# EAGLE design control (EAGLE 9.3.1)
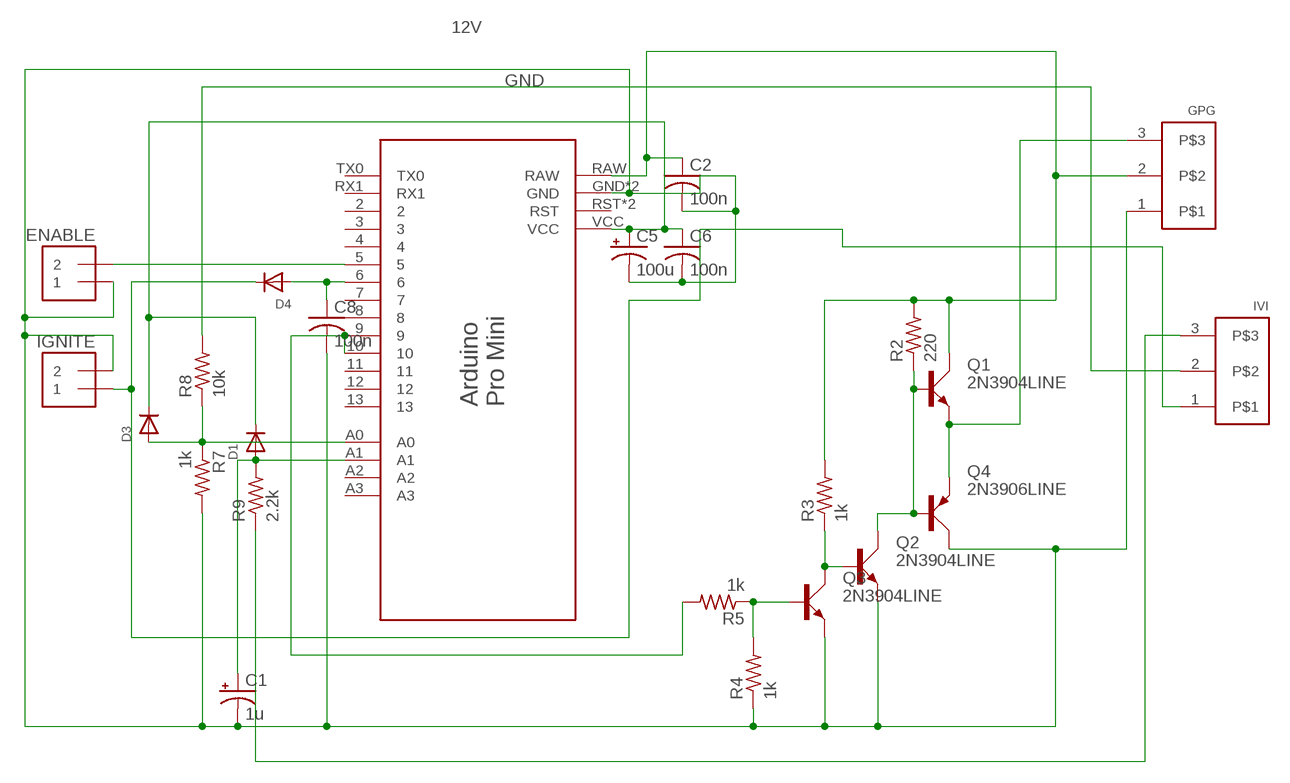
[diagram p0: schematic, sheet 1]

## Parts
C1  1u  CPOL-USE2.5-6  [E2,5-6]
C2  100n  C-US050-030X075  [C050-030X075]
C5  100u  CPOL-USE2.5-6  [E2,5-6]
C6  100n  C-US050-025X075  [C050-025X075]
C8  100n  C-US050-025X075  [C050-025X075]
D1  DIODEDO-1N4148  [DO-1N4148]
D3  DIODEDO-1N4148  [DO-1N4148]
D4  DIODEDO-1N4148  [DO-1N4148]
ENABLE  1X2_12PINS  [1X2PINS]
GPG  1X3_123  [1X3_123]
IGNITE  1X2_12HORZPINS  [1X2HORZ]
IVI  1X3_123  [1X3_123]
Q1  2N3904LINE  [TO92-LINE]
Q2  2N3904LINE  [TO92-LINE]
Q3  2N3904LINE  [TO92-LINE]
Q4  2N3906LINE  [TO92-LINE]
R2  220  R-US_0204/5  [0204/5]
R3  1k  R-US_0207/2V  [0207/2V]
R4  1k  R-US_0207/2V  [0207/2V]
R5  1k  R-US_0207/15  [0207/15]
R7  1k  R-US_0207/5V  [0207/5V]
R8  10k  R-US_0207/15  [0207/15]
R9  2.2k  R-US_0207/12  [0207/12]
U$1  PRO_MINI  [PRO_MINI]

## Nets
12V: C2.1 GPG.2 Q1.C R2.2 R3.2 U$1.RAW
GND: C1.- C2.2 C5.- C6.2 C8.2 ENABLE.1 GPG.1 IGNITE.2 Q2.E Q3.E Q4.C R4.1 R7.2 U$1.GND U$1.GND1(GND)
N$1: D3.A R7.1 R8.1 U$1.A0
N$2: C5.+ C6.1 D1.C D3.C U$1.VCC
N$8: GPG.3 Q1.E Q4.E
N$9: Q3.B R4.2 R5.1
N$10: Q1.B Q2.C Q4.B R2.1
N$11: Q2.B Q3.C R3.1
N$12: R5.2 U$1.9 U$1.10
N$16: C1.+ D1.A R9.2 U$1.A1
N$18: IVI.3 R9.1
N$19: IVI.2 R8.2
N$20: ENABLE.2 U$1.5
N$21: C8.1 D4.A U$1.6
N$22: D4.C IGNITE.1 IVI.1
Unconnected: U$1.2 U$1.3 U$1.4 U$1.7 U$1.8 U$1.11 U$1.12 U$1.13 U$1.A2 U$1.A3 U$1.RST U$1.RST1(RST) U$1.RX1 U$1.TX0

## Library data of the parts
C1 C5 = adafruit:CPOL-US: POLARIZED CAPACITOR, American symbol
C2 C6 C8 = adafruit:C-US: CAPACITOR, American symbol
D1 D3 D4 = adafruit:DIODE: Diode SMADIODE - SMA Surface Mount Package 20V 1A Schottky Diode Digikey: 641-1014-6-ND DO-1N4148 - Through Hole Small Current Diode SOD-123 20V 1 A (.5mV Vf) Schottky Diode - Digikey: MBRX120TPMSCT-ND SOD-323 10V 570mA (.38mV Vf, 3ns) Schottky Diode - Digikey: ZLLS410CT-ND SOD-523 30V 30mA Schottky Diode (RB751S-40TE61) - Digikey: RB751S-40TE61CT-ND SOT23-R/W - SOT23 Package (R = Solder Paste/Reflow Ovens, W = Hand-Soldering) BAT54Film 40V 300mA - Digikey: 497-7162-1-ND
ENABLE IGNITE = aaaacustom:1X2_12: 3.5mm Terminal block http://www.ladyada.net/library/pcb/eaglelibrary.html
GPG IVI = aaaacustom:1X3_123
Q1-Q3 = transistor-small-signal:2N3904: NPN TRANSISTOR
Q4 = transistor-small-signal:2N3906: PNP TRANSISTOR
R2-R5 R7-R9 = adafruit:R-US_: RESISTOR, American symbol
U$1 = Arduino_Pro_Mini:PRO_MINI

## Board
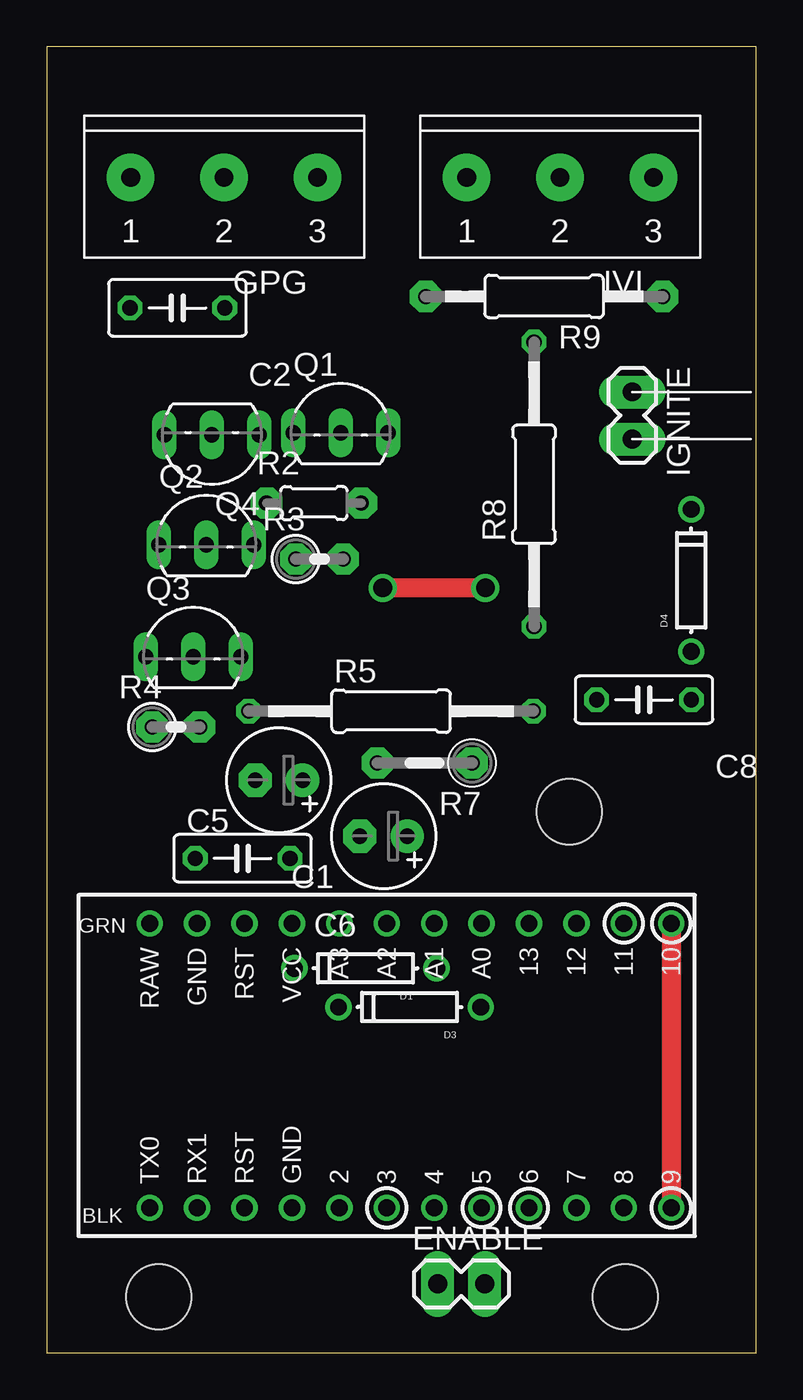
[diagram p1: board, top side]
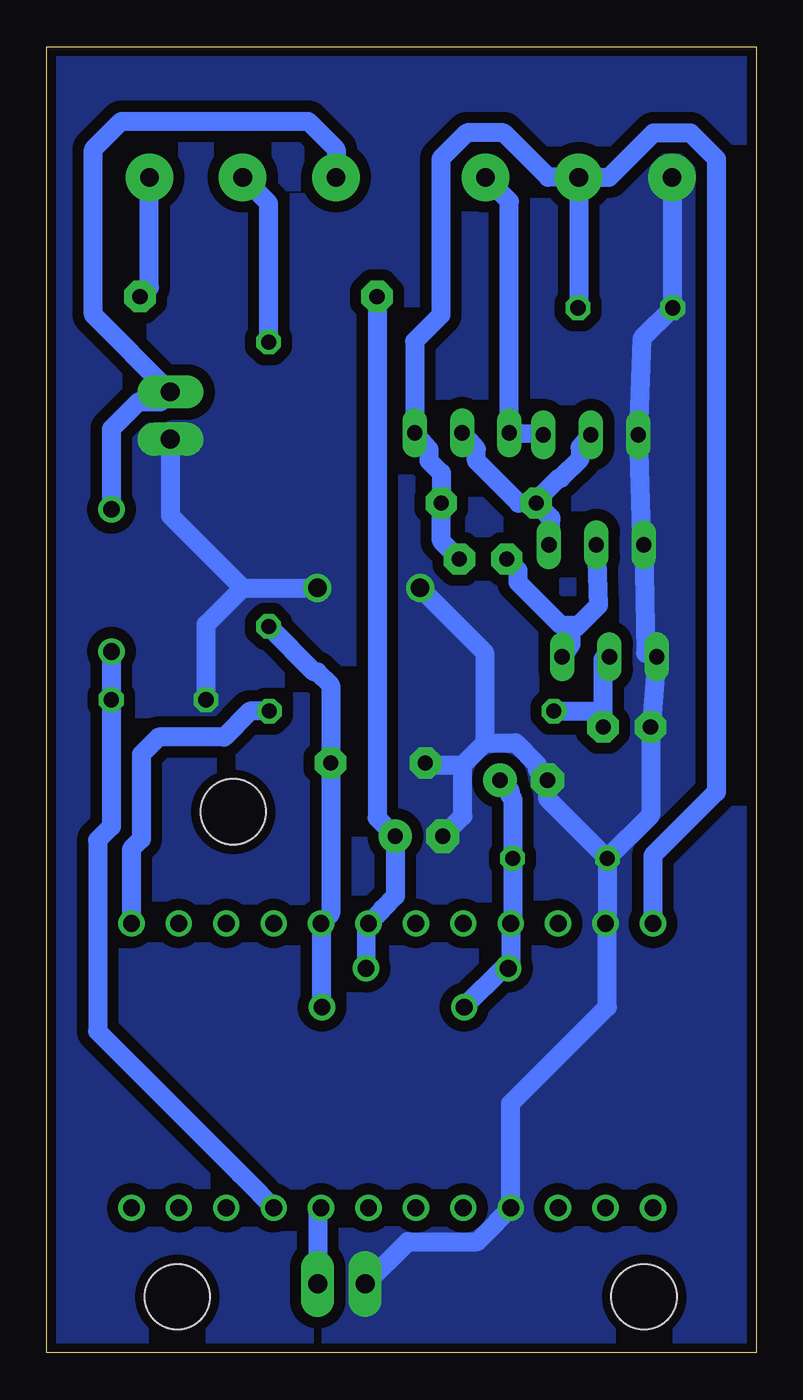
[diagram p2: board, bottom side, seen from below]

Size 38 x 70 mm. Coordinates in mm from the lower left corner, seen from the top.
Outline: 0,0 38,0 38,70 0,70 0,0
Copper layers (1*16): Top 0.035mm / dielectric 1.5mm / Bottom 0.035mm
Design rules "default": minimum track width 1mm, minimum drill 1mm, track to track 0.6mm, track to pad 0.6mm, pad to pad 0.5mm, via to via 0.6mm, smd to smd 6mil, copper to edge 0.5mm, drill to drill 0.5mm, minimum pad ring 10mil, minimum via ring 8mil, stop-mask expansion 4mil, vias tented up to drill 0mil, thermal gap 10mil
Holes 3.5 mm at 28,29 6,3 31,3

### Footprints (pad centres in the part's own frame; a part is rotated, then mirrored left to right if it is on the bottom)
E2,5-6 = drill 0.813 pad 1.778: + -1.27,0 | drill 0.813 pad 1.778 octagon: - 1.27,0
C050-030X075 = drill 0.813 octagon: 1 -2.54,0; 2 2.54,0
C050-025X075 = drill 0.813 octagon: 1 -2.54,0; 2 2.54,0
DO-1N4148 = drill 0.9: A -3.81,0; C 3.81,0
1X2PINS = drill 1.016 pad 1.778 long: 1 0,0; 2 2.54,0
1X3_123 = drill 1 pad 2.54: 1 0,0; 2 5,0; 3 10,0
1X2HORZ = drill 1.016 pad 1.778 long: 1 0,0; 2 2.54,0
TO92-LINE = drill 0.813 long: B 0,0; C 2.54,0; E -2.54,0
0204/5 = drill 0.813 pad 1.676 octagon: 1 -2.54,0; 2 2.54,0
0207/2V = drill 0.813 pad 1.676 octagon: 1 -1.27,0; 2 1.27,0
0207/15 = drill 0.813 octagon: 1 -7.62,0; 2 7.62,0
0207/5V = drill 0.813 pad 1.676 octagon: 1 -2.54,0; 2 2.54,0
0207/12 = drill 0.813 pad 1.676 octagon: 1 -6.35,0; 2 6.35,0
PRO_MINI = drill 0.9: 2 1.524,19.05; 3 1.524,16.51; 4 1.524,13.97; 5 1.524,11.43; 6 1.524,8.89; 7 1.524,6.35; 8 1.524,3.81; 9 1.524,1.27; 10 16.764,1.27; 11 16.764,3.81; 12 16.764,6.35; 13 16.764,8.89; A0 16.764,11.43; A1 16.764,13.97; A2 16.764,16.51; A3 16.764,19.05; GND 1.524,21.59; GND1 16.764,26.67; RAW 16.764,29.21; RST 16.764,24.13; RST1 1.524,24.13; RX1 1.524,26.67; TX0 1.524,29.21; VCC 16.764,21.59

### Placement (x,y rotation side)
C1  18.05,27.69 180 top
C2  7,56 180 top
C5  12.44,30.69 180 top
C6  10.5,26.5 180 top
C8  32,35 180 top
D1  17.08,20.61 180 top
D3  19.44,18.53 180 top
D4  34.53,41.4 90 top
ENABLE  20.94,3.69 0 top
GPG  4.5,63 0 top
IGNITE  31.37,51.5 270 top
IVI  22.5,63 0 top
Q1  15.75,49.3 0 top
Q2  8.55,43.3 0 top
Q3  7.85,37.3 0 top
Q4  8.85,49.2 180 top
R2  14.32,45.54 0 top
R3  14.62,42.54 0 top
R4  6.92,33.54 0 top
R5  18.45,34.39 0 top
R7  20.25,31.61 180 top
R8  26.11,46.55 90 top
R9  26.65,56.61 180 top
U$1  34.73,6.25 90 top

### Tracks (layer width: path | path; a pad name or v marks a point on that pad's centre or on a via)
12V
  Bottom 1.016: R3.2 16.86,43.51 R2.2 16.86,47.15 17.52,47.81 17.52,48.43 Q1.C 18.29,54.21 16.88,55.62 16.88,63.98 15.48,65.38 13.52,65.38 11.14,63 GPG.2 | GPG.2 9.5,56.04 C2.1 | U$1.RAW 5.52,26.66 2.12,30.05 2.12,63.98 3.52,65.38 5.49,65.38 7.86,63 GPG.2
GND  (via drill 1)
  Top 1.016: v23.5,41 v18,41
  Bottom 1.016: C6.2 11.17,29.71 C5.- 11.71,31.23 11.71,31.52 12.88,32.69 14.54,32.69 | 15.71,31.52 14.54,32.69 | C1.- 15.71,28.76 15.71,31.52 | R7.2 17.62,31.52 15.71,31.52 | C6.2 5.65,28.81 R4.1 5.61,33.58 Q3.E 5.91,37.5 Q2.E 6.11,42.9 Q4.C 6.11,54.35 C2.2 4.5,56.04 GPG.1 | C6.2 7.96,23.11 | 7.96,23.11 U$1.GND1 | ENABLE.1 18.67,5.96 14.93,5.96 13.87,7.02 13.87,7.05 U$1.GND 13.14,13.36 7.96,18.54 7.96,23.11 | IGNITE.2 31.37,44.87 27.5,41 | 27.5,41 v23.5,41 | v18,41 14.54,37.54 14.54,32.69 | C8.2 29.46,39.04 27.5,41
  pour Bottom (no thermals): 0,70 0,0 38,0 38,70
N$1
  Bottom 1.016: D3.A 23.3,18.58 U$1.A0 22.79,23.52 R7.1 22.79,35.79 23.5,36.5 23.68,36.5 R8.1
N$2
  Bottom 1.016: C5.+ 13.17,30.15 13.17,29.86 13.04,29.74 C6.1 13.04,23.11 U$1.VCC 13.14,20.74 D1.C 13.55,20.61 D3.C
N$8
  Bottom 1.016: Q4.E 13.11,49.3 Q1.E 13.21,61.71 GPG.3
N$9
  Bottom 1.016: R4.2 8.19,34.5 | 8.19,34.5 8.19,37.16 Q3.B | R5.1 8.3,34.39 8.19,34.5
N$10
  Bottom 1.016: Q1.B 14.98,48.43 14.98,47.81 12.71,45.54 R2.1 | R2.1 11.78,45.67 10.58,46.87 10.46,46.87 9.42,47.91 9.42,48.53 Q4.B | R2.1 10.99,44.75 Q2.C
N$11
  Bottom 1.016: Q3.C 9.92,37.97 9.92,38.59 9.51,39.01 | Q2.B 8.45,40.06 9.51,39.01 | R3.1 12.76,41.95 12.76,41.31 10.46,39.01 9.51,39.01
N$12
  Top 1.016: U$1.10 U$1.9
  Bottom 1.016: U$1.10 33.46,27 32.92,27.54 32.92,32.08 32,33 28.5,33 27.11,34.39 R5.2
N$16
  Bottom 1: D1.A 20.89,23.01 U$1.A1
  Bottom 1.016: U$1.A1 20.03,23.74 20.03,23.77 19.32,24.48 C1.+ 20.3,28.67 R9.2
N$18
  Bottom 1.016: R9.1 32.5,57.11 IVI.3
N$19
  Bottom 1.016: R8.2 26.11,61.61 IVI.2
N$20
  Bottom 1.016: U$1.5 23.48,7.59 ENABLE.2
N$21
  Bottom 1.016: U$1.6 26.57,8.5 26.57,8.53 27.63,9.59 | 27.63,9.59 27.65,9.59 | D4.A C8.1 34.54,28.2 35.27,27.47 35.27,17.23 27.63,9.59
N$22
  Bottom 1.016: IVI.1 22.5,64.5 24,66 34,66 35.5,64.5 35.5,55.63 IGNITE.1 31.91,50.96 33.09,50.96 34.53,49.51 D4.C